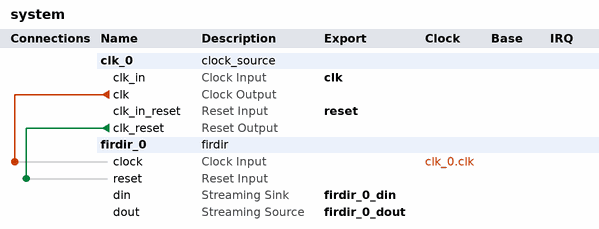
[diagram p0: system contents]
# Platform Designer (Qsys) system system, Cyclone V 5CGXFC7C7F23C8
# Parameters at their usual value, and those the tool derives, are not listed.
package require -exact qsys 18.1
create_system system
set_project_property DEVICE_FAMILY {Cyclone V}
set_project_property DEVICE 5CGXFC7C7F23C8

add_instance clk_0 clock_source 18.1
set_instance_parameter_value clk_0 clockFrequency 50000000

add_instance firdir_0 firdir 1.0
set_instance_parameter_value firdir_0 ACC_WIDTH 21
set_instance_parameter_value firdir_0 COEF_INIT_FILE ../rtl/romcoef.mif
set_instance_parameter_value firdir_0 COEF_WIDTH 18
set_instance_parameter_value firdir_0 DIN_WIDTH 18
set_instance_parameter_value firdir_0 DOUT_SHIFT 1
set_instance_parameter_value firdir_0 DOUT_WIDTH 18
set_instance_parameter_value firdir_0 FIR_ORDER 511

# connections
add_connection clk_0.clk firdir_0.clock clock
add_connection clk_0.clk_reset firdir_0.reset reset

# exported interfaces
add_interface clk clock sink
set_interface_property clk EXPORT_OF clk_0.clk_in
add_interface firdir_0_din avalon_streaming sink
set_interface_property firdir_0_din EXPORT_OF firdir_0.din
add_interface firdir_0_dout avalon_streaming source
set_interface_property firdir_0_dout EXPORT_OF firdir_0.dout
add_interface reset reset sink
set_interface_property reset EXPORT_OF clk_0.clk_in_reset

set_interconnect_requirement {$system} qsys_mm.clockCrossingAdapter HANDSHAKE
set_interconnect_requirement {$system} qsys_mm.enableEccProtection FALSE
set_interconnect_requirement {$system} qsys_mm.insertDefaultSlave FALSE
set_interconnect_requirement {$system} qsys_mm.maxAdditionalLatency 1

save_system system.qsys
